# Altium schematic sheet [06] - DOC REVISION HISTORY.SchDoc
size A3; DocumentNumber: 6; SheetNumber: 6; SheetTotal: 7
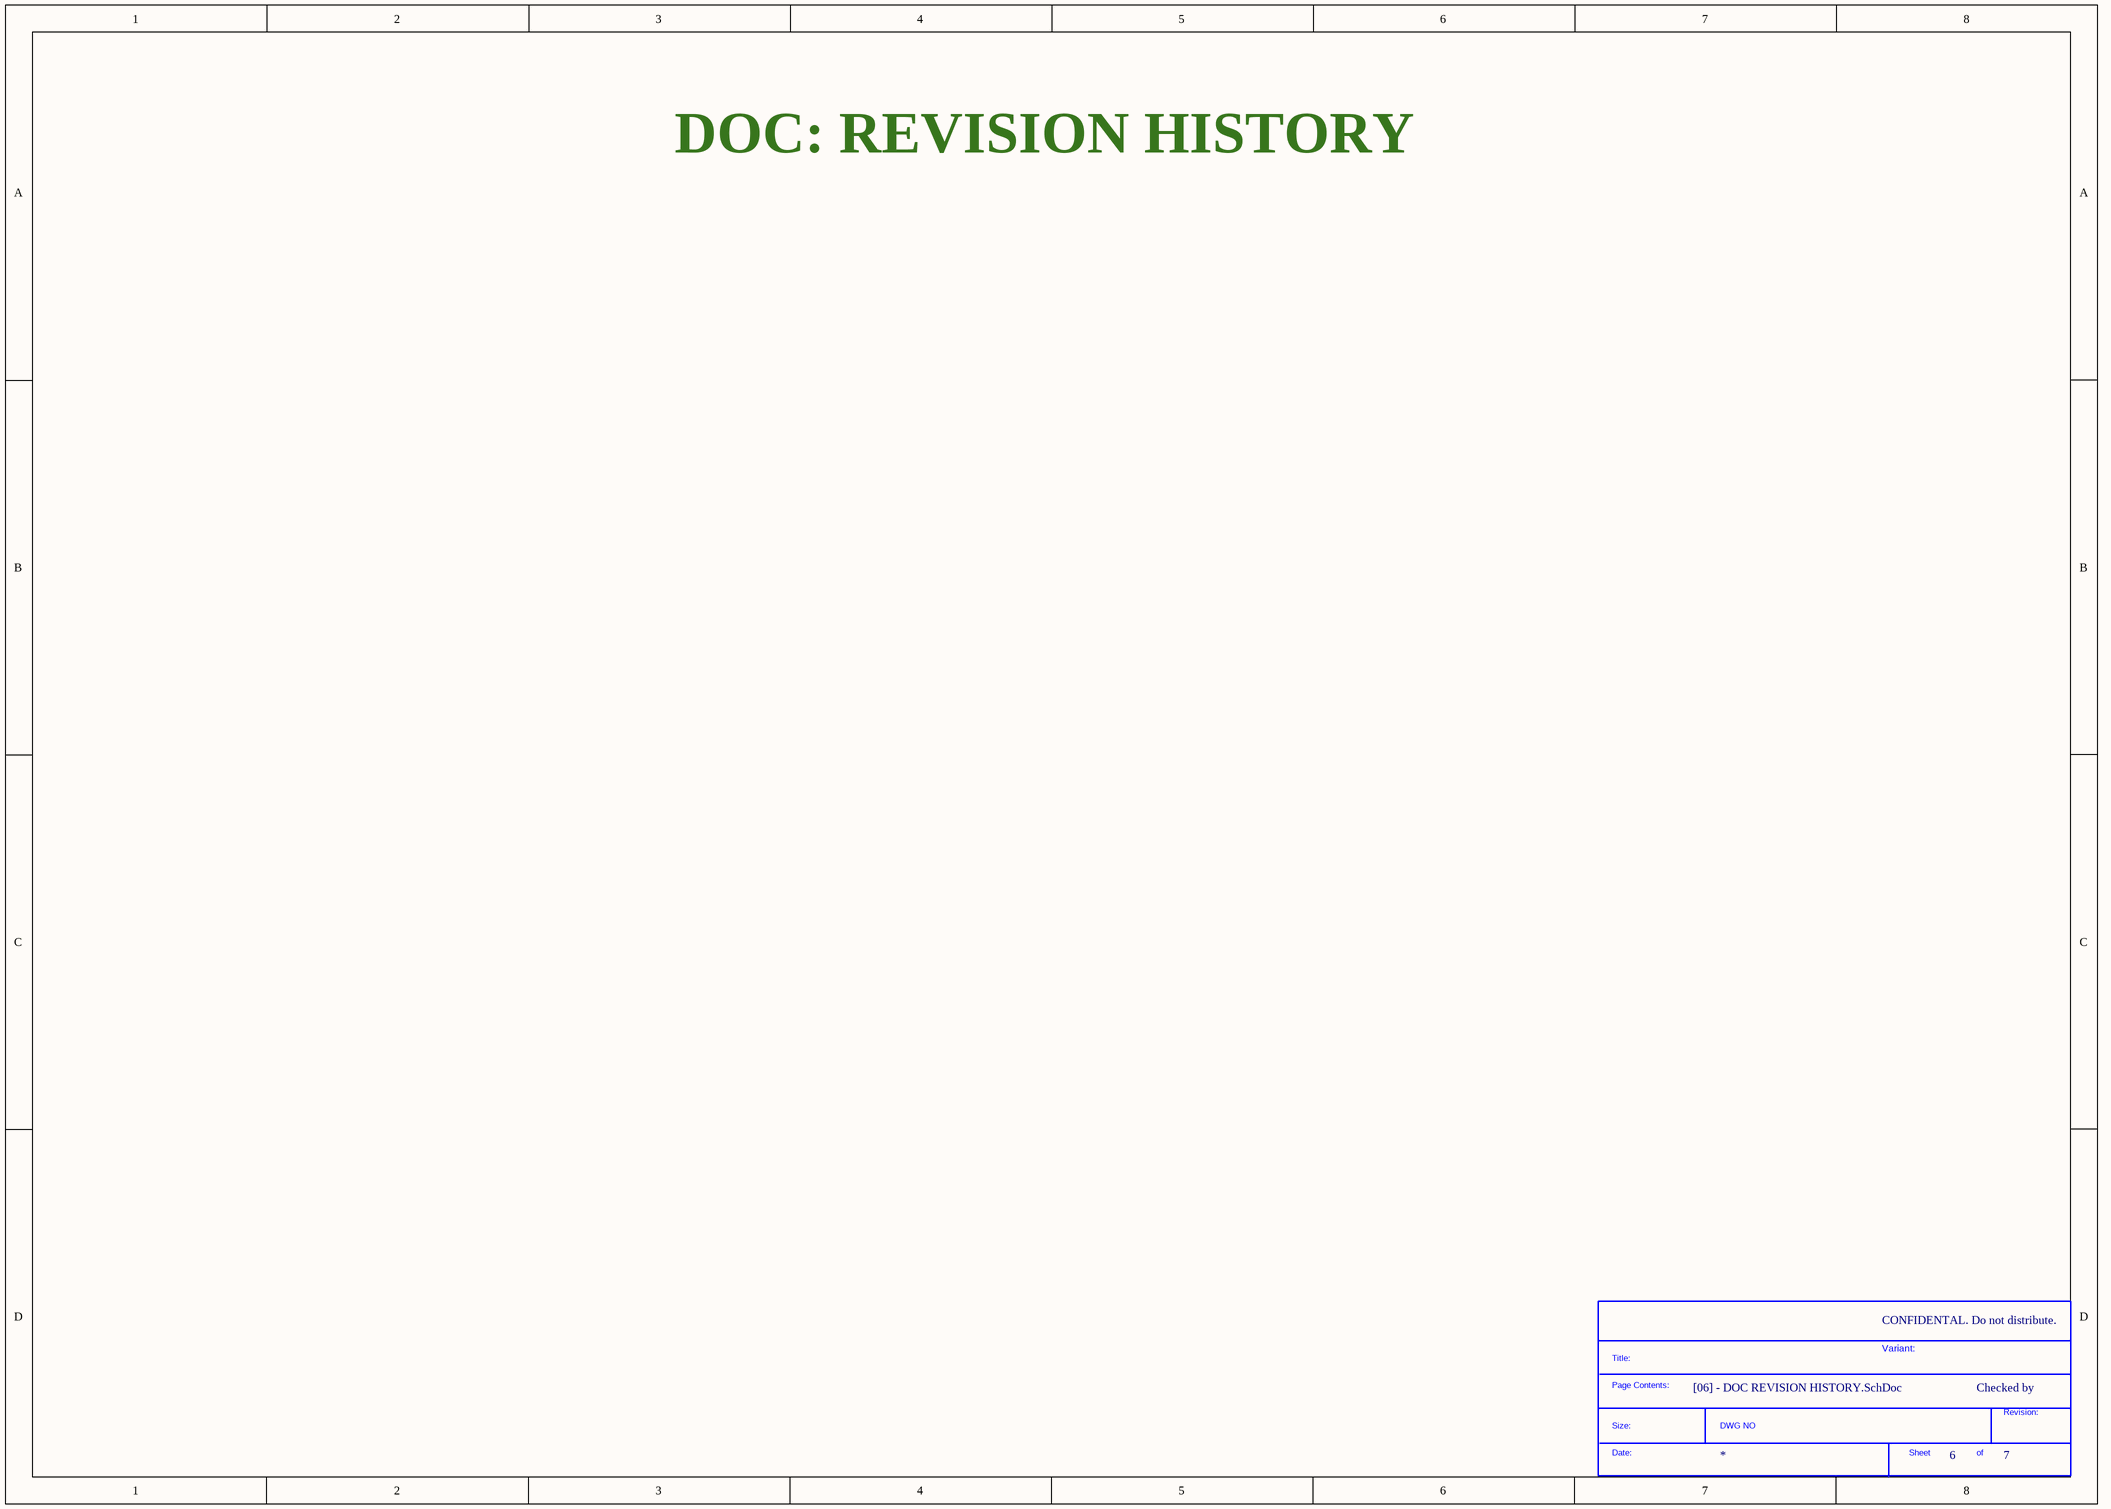
[diagram p0: [06] - DOC REVISION HISTORY.SchDoc]

## Parts
*  SDTitleBlock  (value not drawn)  (graphical)

## Notes on the sheet
- DOC: REVISION HISTORY
- CONFIDENTAL. Do not distribute.
- CLOCKS (CPU & PCIE)
- Variant:
- Checked by
- (in symbol SDTitleBlock) Title:; Page Contents:; Revision:; Size:; DWG NO; Date:; Sheet; of